# Altium schematic sheet CONNECTOR.SchDoc
size A4
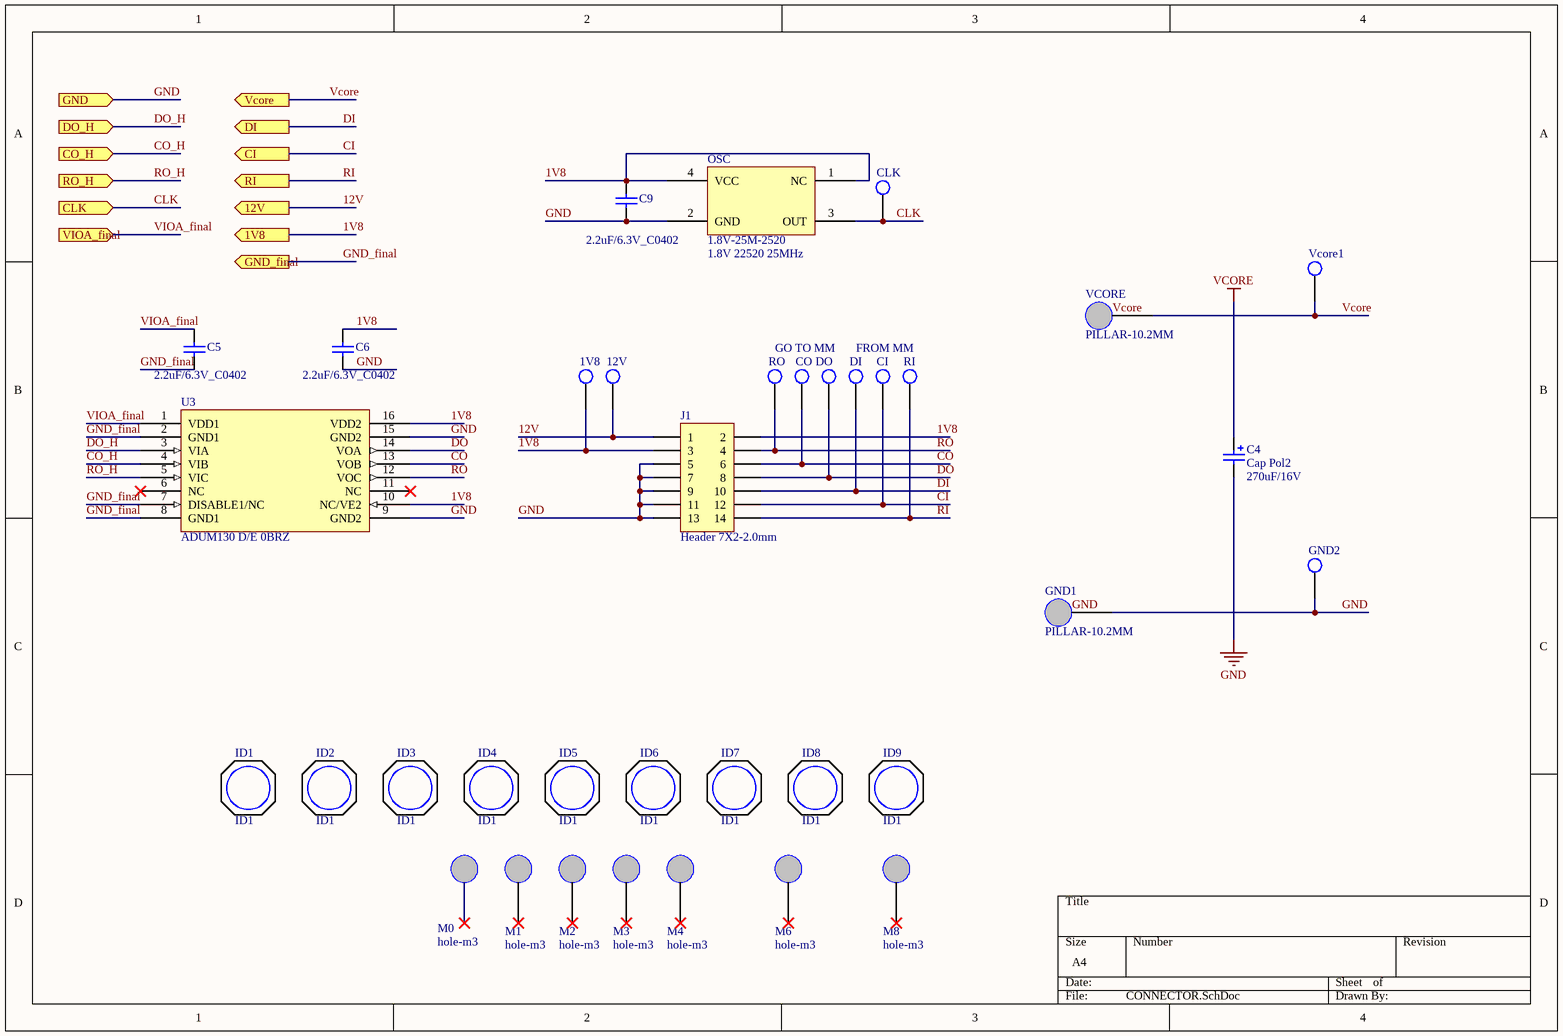
[diagram p0: CONNECTOR.SchDoc]

## Parts
1V8  Socket  [tp50]  (value not drawn)
12V  Socket  [tp50]  (value not drawn)
C4  Cap Pol2  value 270uF/16V  [c6666-100]
C5  value 2.2uF/6.3V_C0402  [c0402]  (hidden comment: Cap)
C6  value 2.2uF/6.3V_C0402  [c0402]  (hidden comment: Cap)
C9  value 2.2uF/6.3V_C0402  [c0402]  (hidden comment: Cap)
CI  Socket  [tp50]  (value not drawn)
CLK  Socket  [tp28]  (value not drawn)
CO  Socket  [tp50]  (value not drawn)
DI  Socket  [tp50]  (value not drawn)
DO  Socket  [tp50]  (value not drawn)
GND1  PILLAR-10.2MM  [PILLAR-10_2MM]
GND2  Socket  [tp40]  (value not drawn)
ID1  ID1  [ID1]
ID2  ID1  [ID1]
ID3  ID1  [ID1]
ID4  ID1  [ID1]
ID5  ID1  [ID1]
ID6  ID1  [ID1]
ID7  ID1  [ID1]
ID8  ID1  [ID1]
ID9  ID1  [ID1]
J1  Header 7X2-2.0mm  [HEAD-IDC-14-80-275-P2-SMD]
M0  hole-m3  [HOLE-M3-NP-c]
M1  hole-m3  [HOLE-M3-NP-c]
M2  hole-m3  [HOLE-M3-NP-B]
M3  hole-m3  [HOLE-M3-NP-B]
M4  hole-m3  [HOLE-M3-NP-B]
M6  hole-m3  [HOLE-M3-NP-c]
M8  hole-m3  [HOLE-M3-NP-B]
OSC  1.8V-25M-2520  [X4-2520-010]
RI  Socket  [tp50]  (value not drawn)
RO  Socket  [tp50]  (value not drawn)
U3  ADUM130 D/E 0BRZ  [SOP16-50-157-69]
VCORE  PILLAR-10.2MM  [PILLAR-10_2MM]
Vcore1  Socket  [tp40]  (value not drawn)

## Ports
1V8 (out), 12V (out), CI (out), CLK (in), CO_H (in), DI (out), DO_H (in), GND (in), GND_final (out), RI (out), RO_H (in), Vcore (out), VIOA_final (in)

## Nets
GND: C4.2 C6.2 C9.2 GND1.1 GND2.1 J1.5 J1.7 J1.9 J1.11 J1.13 OSC.2(GND) U3.9(GND2) U3.15(GND2) ; port GND
Vcore: C4.1 VCORE.1 Vcore1.1 ; port Vcore
1V8: 1V8.1 C6.1 C9.1 J1.2 J1.3 OSC.1(NC) OSC.4(VCC) U3.10(NC/VE2) U3.16(VDD2) ; port 1V8
12V: 12V.1 J1.1 ; port 12V
CI: CI.1 J1.12 ; port CI
CLK: CLK.1 OSC.3(OUT) ; port CLK
CO: CO.1 J1.6 U3.13(VOB)
CO_H: U3.4(VIB) ; port CO_H
DI: DI.1 J1.10 ; port DI
DO: DO.1 J1.8 U3.14(VOA)
DO_H: U3.3(VIA) ; port DO_H
GND_final: C5.2 U3.2(GND1) U3.7(DISABLE1/NC) U3.8(GND1) ; port GND_final
RI: J1.14 RI.1 ; port RI
RO: J1.4 RO.1 U3.12(VOC)
RO_H: U3.5(VIC) ; port RO_H
VIOA_final: C5.1 U3.1(VDD1) ; port VIOA_final

Not connected (* = marked no-connect by the designer): M0 1*; M1 1; M2 1; M3 1; M4 1; M6 1; M8 1; U3 6(NC)* 11(NC)*

## Notes on the sheet
- GO TO MM
- FROM MM
- (in symbol OS) 1.8V 22520 25MHz

## Library data of the parts
1V8 12V CI CLK CO DI DO GND2 RI RO Vcore1 = Socket: TP; LatestRevisionDate: 17-Jul-2002; LatestRevisionNote: Re-released for DXP Platform.; Publisher: Altium Limited
C4 = Cap Pol2: Polarized Capacitor (Axial); Published: 8-Jun-2000; LatestRevisionDate: 17-Jul-2002; LatestRevisionNote: Re-released for DXP Platform.; PackageReference: POLAR0.8; Publisher: Altium Limited; PackageDescription: Polarized Capacitor; 2 Leads
C5 C6 C9 = Cap: Capacitor; Published: 8-Jun-2000; LatestRevisionDate: 17-Jul-2002; LatestRevisionNote: Re-released for DXP Platform.; PackageReference: RAD-0.3; Publisher: Altium Limited
GND1 VCORE = COMBICON
ID1-ID9 = Component_1
J1 = Header 7X2: Header, 7-Pin, Dual row; LatestRevisionDate: 17-Jul-2002; LatestRevisionNote: Re-released for DXP Platform.; Publisher: Altium Limited
OSC = OS: 1.8V 有源 12MHz晶振
U3 = ADUM130 D/E BRZ